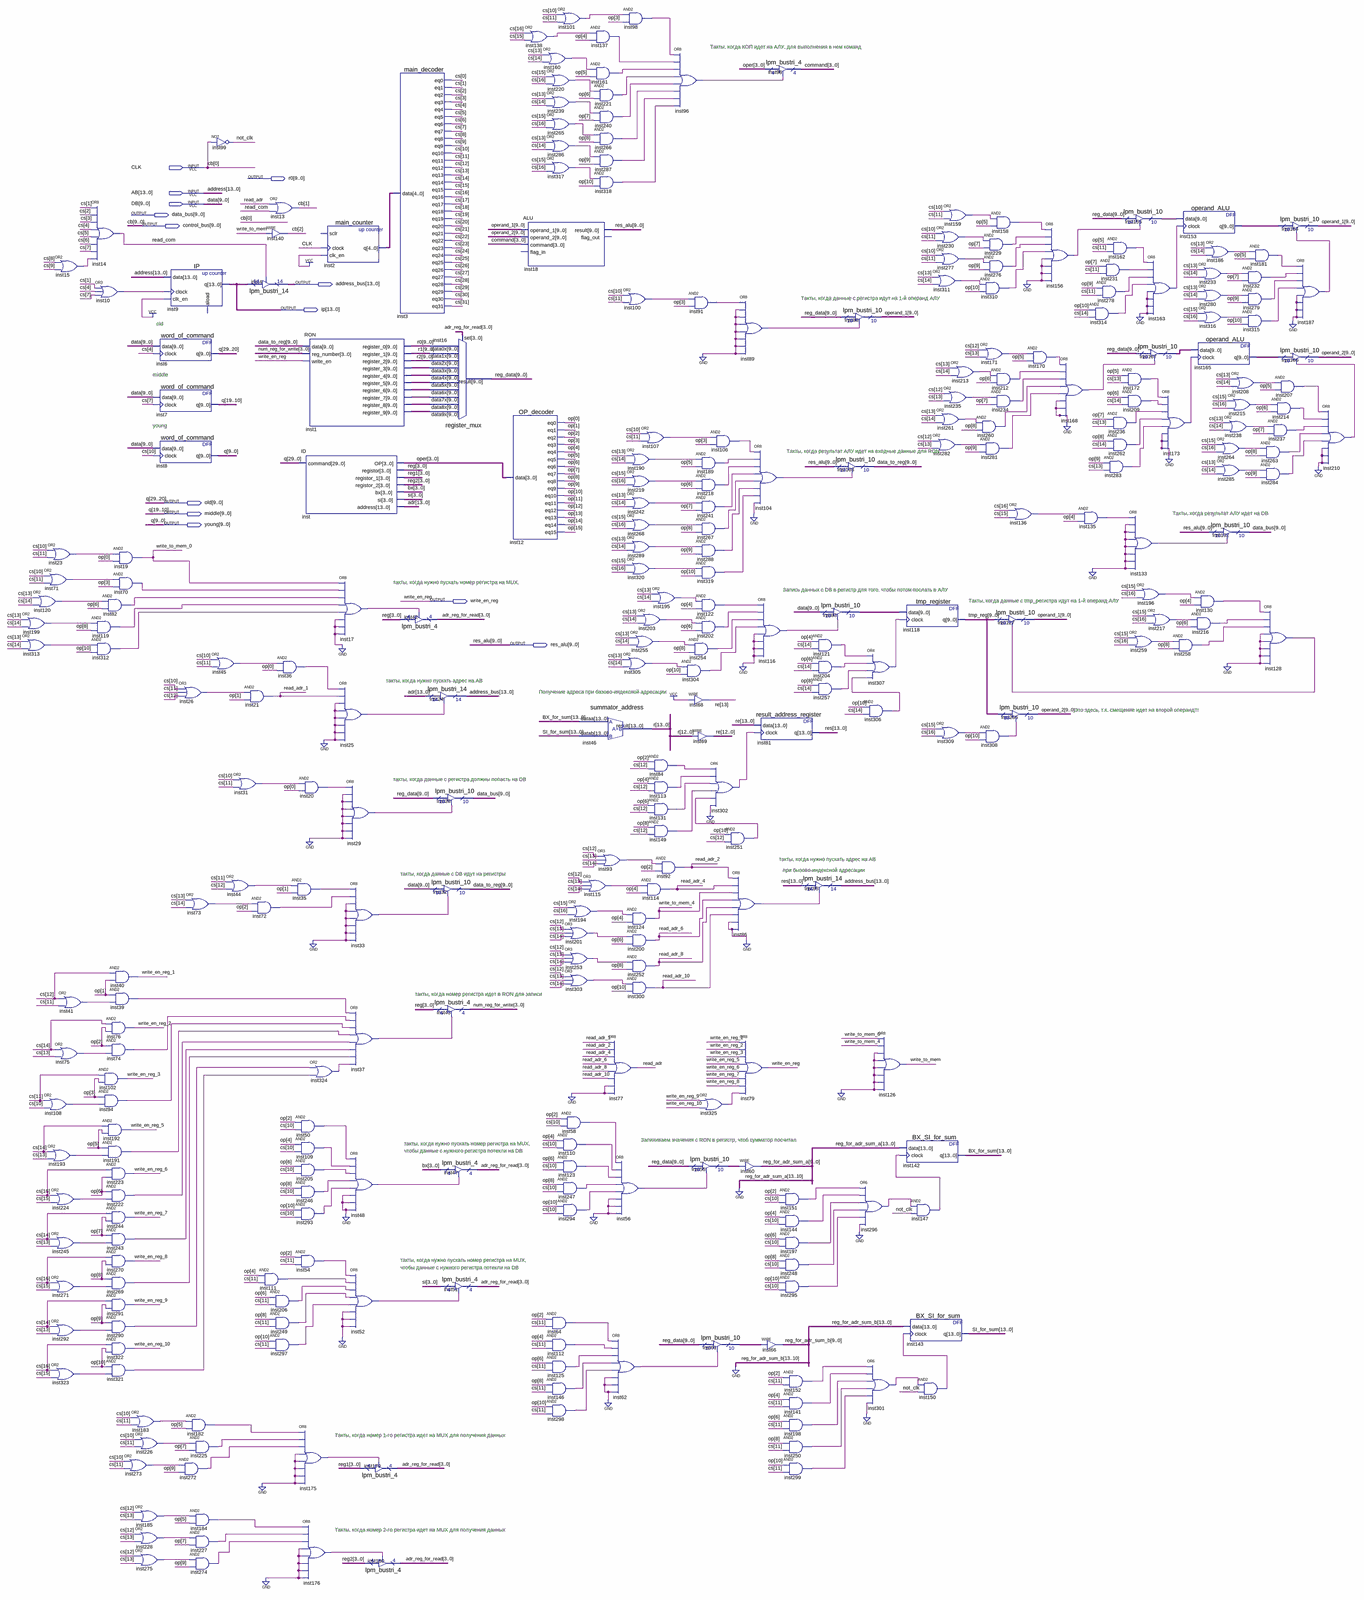
[diagram p0: schematic sheet, whole]
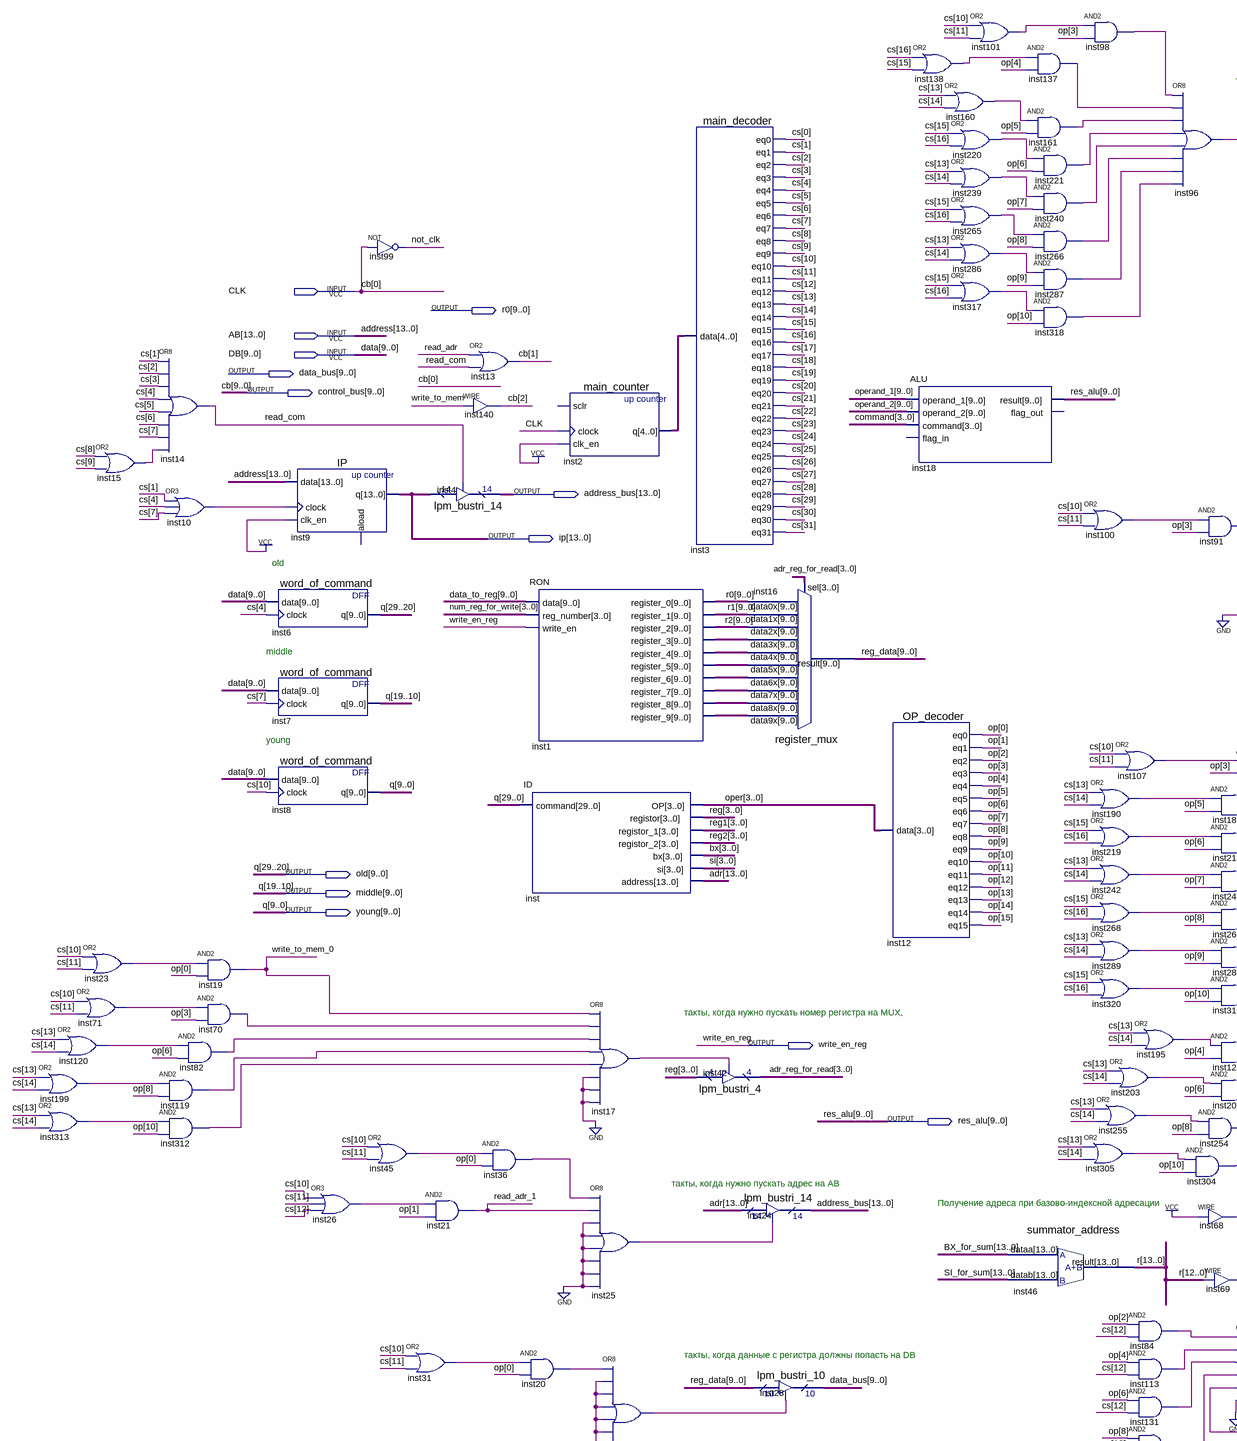
[diagram p1: schematic sheet, upper left part]
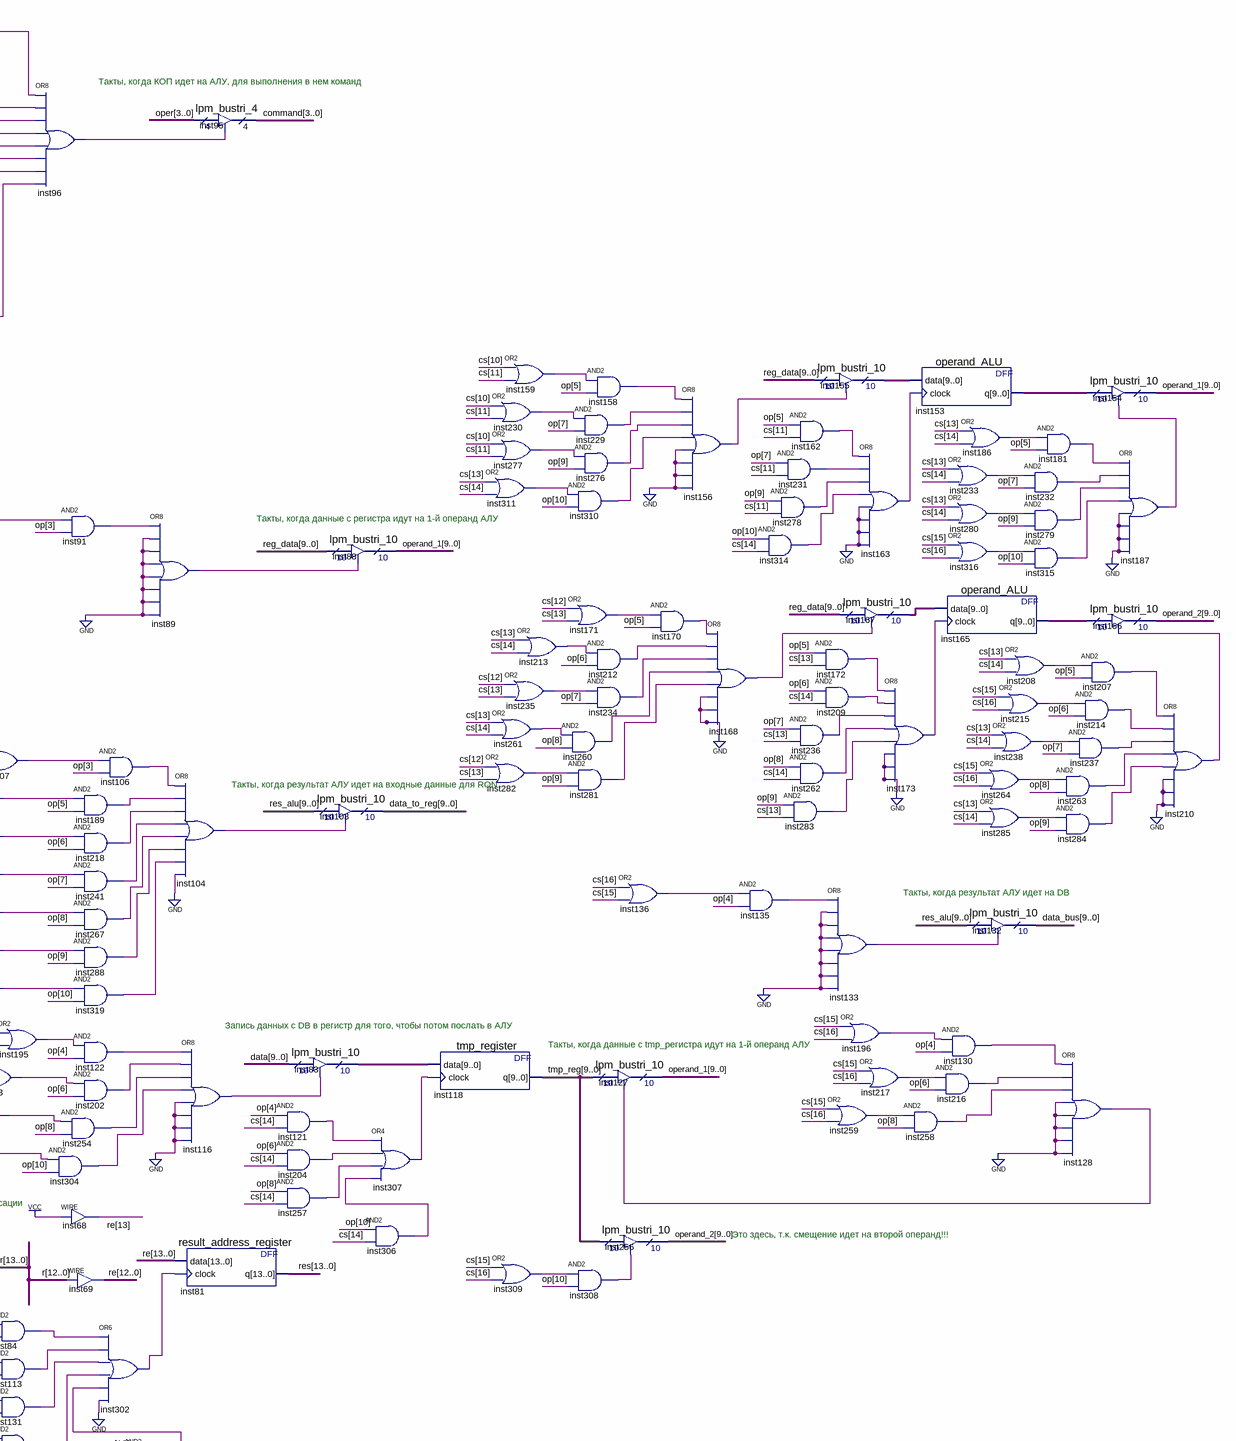
[diagram p2: schematic sheet, upper right part]
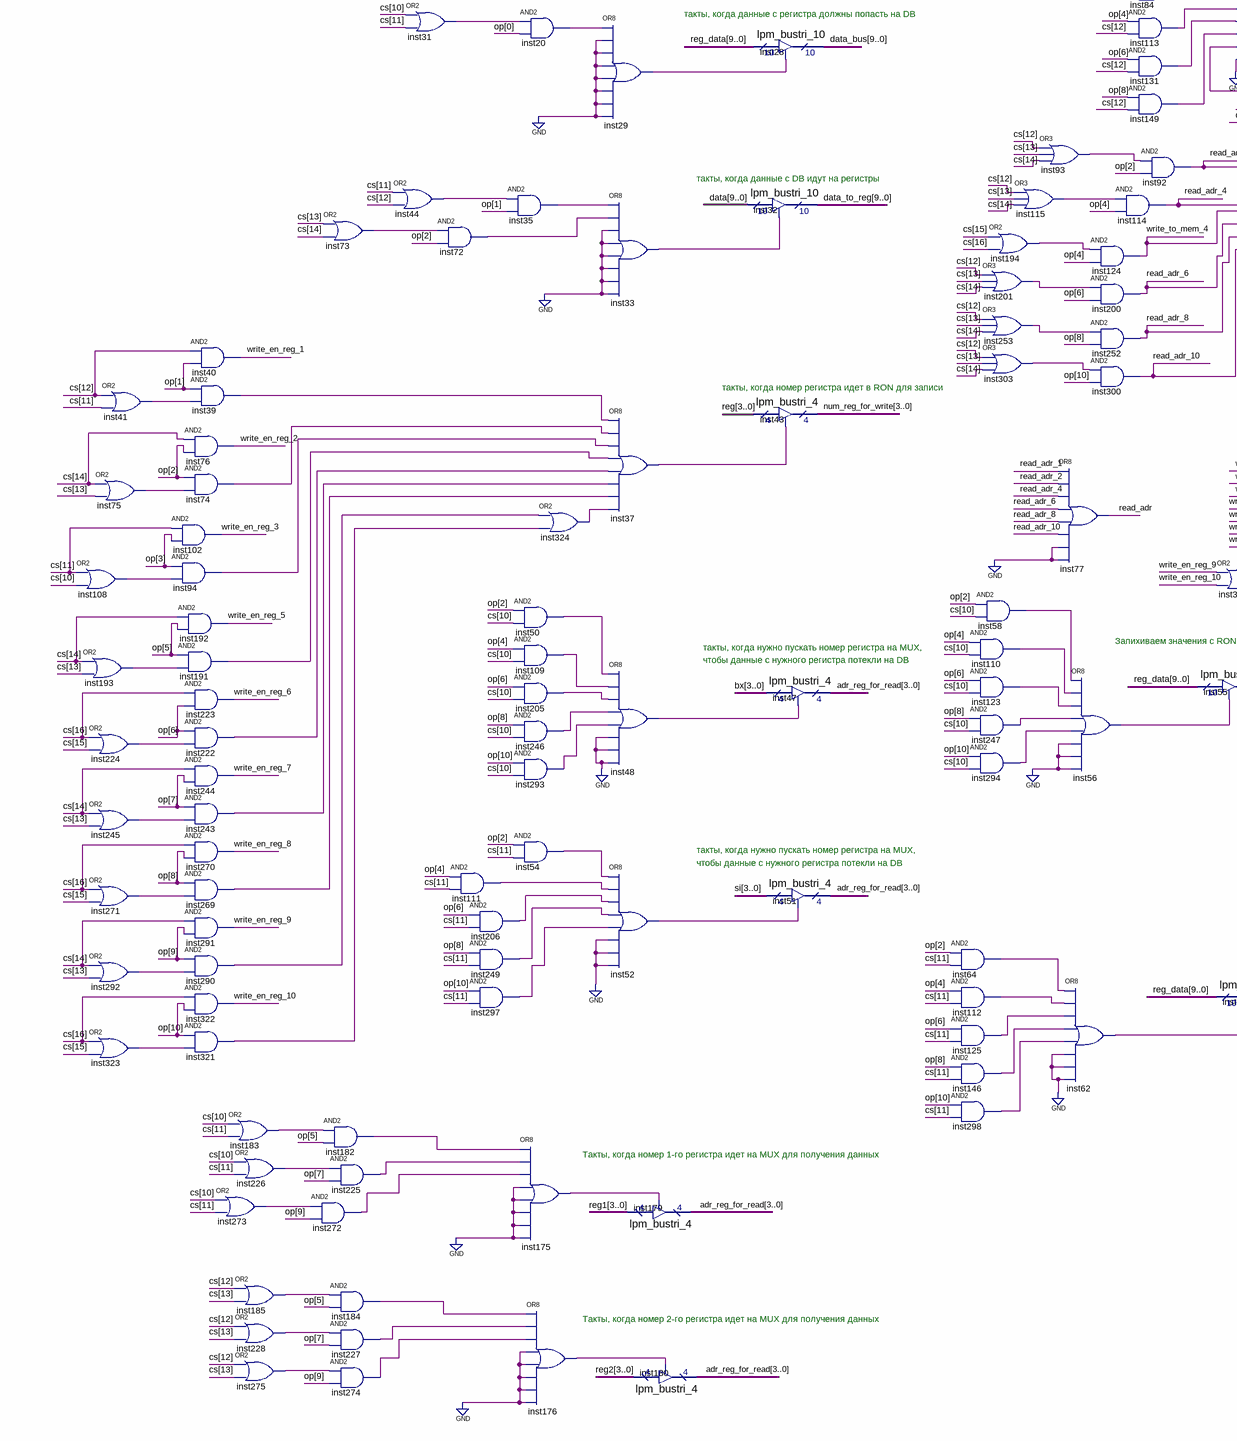
[diagram p3: schematic sheet, lower left part]
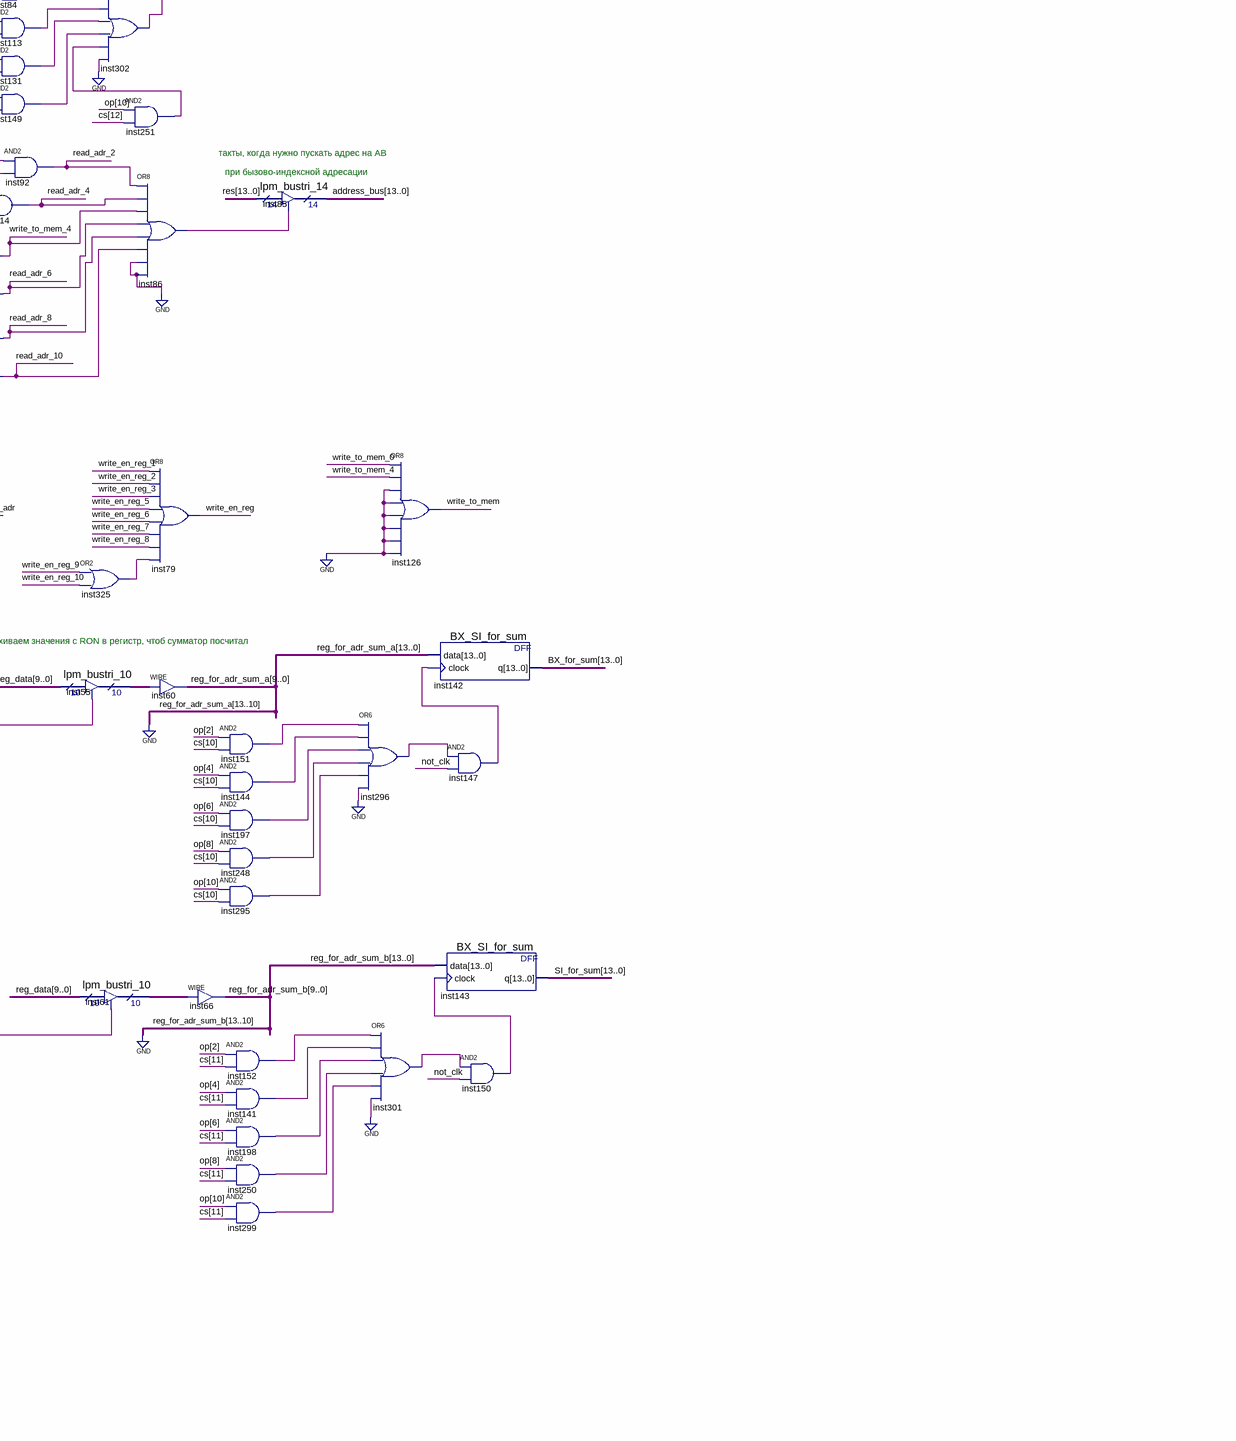
[diagram p4: schematic sheet, lower right part]
// Quartus schematic CPU.bdf as structural Verilog: 292 symbols, 13 pins
module CPU (
  input  CLK,
  input  [13:0] AB,
  input  [9:0] DB,
  output [9:0] r0,
  output [9:0] data_bus,
  output [9:0] control_bus,
  output [13:0] address_bus,
  output [13:0] ip,
  output [9:0] old,
  output [9:0] middle,
  output [9:0] young,
  output write_en_reg,
  output [9:0] res_alu
);

  wire inst10_out, inst15_out, inst17_out, inst20_out, inst23_out, inst25_out, inst26_out, inst29_out,
       inst31_out, inst33_out, inst35_out, inst36_out, inst37_out, inst39_out, inst41_out, inst44_out,
       inst45_out, inst48_out, inst50_out, inst52_out, inst54_out, inst56_out, inst58_out, inst62_out,
       inst64_out, inst70_out, inst71_out, inst72_out, inst73_out, inst74_out, inst75_out, inst82_out,
       inst84_out, inst86_out, inst89_out, inst91_out, inst93_out, inst94_out, inst96_out, inst98_out,
       inst100_out, inst101_out, inst104_out, inst106_out, inst107_out, inst108_out, inst109_out,
       inst110_out, inst111_out, inst112_out, inst113_out, inst115_out, inst116_out, inst119_out,
       inst120_out, inst121_out, inst122_out, inst123_out, inst125_out, inst128_out, inst130_out,
       inst131_out, inst133_out, inst135_out, inst136_out, inst137_out, inst138_out, inst141_out,
       inst144_out, inst146_out, inst147_out, inst149_out, inst150_out, inst151_out, inst152_out,
       inst156_out, inst158_out, inst159_out, inst160_out, inst161_out, inst162_out, inst163_out,
       inst168_out, inst170_out, inst171_out, inst172_out, inst173_out, inst175_out, inst176_out,
       inst181_out, inst182_out, inst183_out, inst184_out, inst185_out, inst186_out, inst187_out,
       inst189_out, inst190_out, inst191_out, inst193_out, inst194_out, inst195_out, inst196_out,
       inst197_out, inst198_out, inst199_out, inst201_out, inst202_out, inst203_out, inst204_out,
       inst205_out, inst206_out, inst207_out, inst208_out, inst209_out, inst210_out, inst212_out,
       inst213_out, inst214_out, inst215_out, inst216_out, inst217_out, inst218_out, inst219_out,
       inst220_out, inst221_out, inst222_out, inst224_out, inst225_out, inst226_out, inst227_out,
       inst228_out, inst229_out, inst230_out, inst231_out, inst232_out, inst233_out, inst234_out,
       inst235_out, inst236_out, inst237_out, inst238_out, inst239_out, inst240_out, inst241_out,
       inst242_out, inst243_out, inst245_out, inst246_out, inst247_out, inst248_out, inst249_out,
       inst250_out, inst251_out, inst253_out, inst254_out, inst255_out, inst257_out, inst258_out,
       inst259_out, inst260_out, inst261_out, inst262_out, inst263_out, inst264_out, inst265_out,
       inst266_out, inst267_out, inst268_out, inst269_out, inst271_out, inst272_out, inst273_out,
       inst274_out, inst275_out, inst276_out, inst277_out, inst278_out, inst279_out, inst280_out,
       inst281_out, inst282_out, inst283_out, inst284_out, inst285_out, inst286_out, inst287_out,
       inst288_out, inst289_out, inst290_out, inst292_out, inst293_out, inst294_out, inst295_out,
       inst296_out, inst297_out, inst298_out, inst299_out, inst301_out, inst302_out, inst303_out,
       inst304_out, inst305_out, inst306_out, inst307_out, inst308_out, inst309_out, inst310_out,
       inst311_out, inst312_out, inst313_out, inst314_out, inst315_out, inst316_out, inst317_out,
       inst318_out, inst319_out, inst320_out, inst321_out, inst323_out, inst324_out, inst325_out, not_clk,
       read_adr, read_adr_1, read_adr_2, read_adr_4, read_adr_6, read_adr_8, read_adr_10, read_com,
       write_en_reg_1, write_en_reg_2, write_en_reg_3, write_en_reg_5, write_en_reg_6, write_en_reg_7,
       write_en_reg_8, write_en_reg_9, write_en_reg_10, write_to_mem, write_to_mem_0, write_to_mem_4;
  wire [3:0] adr_reg_for_read, bx, command, num_reg_for_write, oper, \reg , reg1, reg2, si;
  wire [4:0] inst2_q;
  wire [9:0] data_to_reg, inst1_register_3, inst1_register_4, inst1_register_5, inst1_register_6,
       inst1_register_7, inst1_register_8, inst1_register_9, inst55_tridata, inst61_tridata, inst83_tridata,
       inst153_q, inst155_tridata, inst165_q, inst167_tridata, operand_1, operand_2, r1, r2, reg_data,
       reg_for_adr_sum_a, reg_for_adr_sum_b, tmp_reg;
  wire [13:0] adr, BX_for_sum, r, re, res, SI_for_sum;
  wire [15:0] op;
  wire [31:0] cs;

  or inst71 (inst71_out, cs[10], cs[11]);
  or inst120 (inst120_out, cs[13], cs[14]);
  or inst199 (inst199_out, cs[13], cs[14]);
  or inst313 (inst313_out, cs[13], cs[14]);
  or inst108 (inst108_out, cs[11], cs[10]);
  or inst15 (inst15_out, cs[8], cs[9]);
  or inst23 (inst23_out, cs[10], cs[11]);
  or inst41 (inst41_out, cs[12], cs[11]);
  or inst75 (inst75_out, cs[14], cs[13]);
  or inst193 (inst193_out, cs[14], cs[13]);
  or inst224 (inst224_out, cs[16], cs[15]);
  or inst245 (inst245_out, cs[14], cs[13]);
  or inst271 (inst271_out, cs[16], cs[15]);
  or inst292 (inst292_out, cs[14], cs[13]);
  or inst323 (inst323_out, cs[16], cs[15]);
  or inst14 (read_com, cs[1], cs[2], cs[3], cs[4], cs[5], cs[6], cs[7], inst15_out);
  or inst10 (inst10_out, cs[1], cs[4], cs[7]);
  and inst82 (inst82_out, inst120_out, op[6]);
  and inst119 (inst119_out, inst199_out, op[8]);
  and inst312 (inst312_out, inst313_out, op[10]);
  and inst102 (write_en_reg_3, cs[11], op[3]);
  and inst94 (inst94_out, op[3], inst108_out);
  and inst192 (write_en_reg_5, cs[14], op[5]);
  and inst191 (inst191_out, op[5], inst193_out);
  and inst19 (write_to_mem_0, inst23_out, op[0]);
  and inst70 (inst70_out, inst71_out, op[3]);
  and inst40 (write_en_reg_1, cs[12], op[1]);
  and inst39 (inst39_out, op[1], inst41_out);
  and inst76 (write_en_reg_2, cs[14], op[2]);
  and inst74 (inst74_out, op[2], inst75_out);
  and inst223 (write_en_reg_6, cs[16], op[6]);
  and inst222 (inst222_out, op[6], inst224_out);
  and inst244 (write_en_reg_7, cs[14], op[7]);
  and inst243 (inst243_out, op[7], inst245_out);
  and inst270 (write_en_reg_8, cs[16], op[8]);
  and inst269 (inst269_out, op[8], inst271_out);
  and inst291 (write_en_reg_9, cs[14], op[9]);
  and inst290 (inst290_out, op[9], inst292_out);
  and inst322 (write_en_reg_10, cs[16], op[10]);
  and inst321 (inst321_out, op[10], inst323_out);
  or inst183 (inst183_out, cs[10], cs[11]);
  or inst273 (inst273_out, cs[10], cs[11]);
  word_of_command inst6 (.data(DB), .clock(cs[4]), .q(old));
  word_of_command inst7 (.data(DB), .clock(cs[7]), .q(middle));
  word_of_command inst8 (.data(DB), .clock(cs[10]), .q(young));
  or inst226 (inst226_out, cs[10], cs[11]);
  or inst185 (inst185_out, cs[12], cs[13]);
  or inst228 (inst228_out, cs[12], cs[13]);
  or inst275 (inst275_out, cs[12], cs[13]);
  IP inst9 (.data(AB), .clock(inst10_out), .clk_en(1'b1), .q(ip));  // open: aload
  or inst26 (inst26_out, cs[10], cs[11], cs[12]);
  or inst73 (inst73_out, cs[13], cs[14]);
  and inst182 (inst182_out, inst183_out, op[5]);
  and inst225 (inst225_out, inst226_out, op[7]);
  and inst272 (inst272_out, inst273_out, op[9]);
  and inst184 (inst184_out, inst185_out, op[5]);
  and inst227 (inst227_out, inst228_out, op[7]);
  and inst274 (inst274_out, inst275_out, op[9]);
  not inst99 (not_clk, CLK);
  or inst45 (inst45_out, cs[10], cs[11]);
  lpm_bustri_14 inst4 (.enabledt(read_com), .data(ip), .tridata(address_bus));
  and inst21 (read_adr_1, inst26_out, op[1]);
  or inst31 (inst31_out, cs[10], cs[11]);
  or inst44 (inst44_out, cs[11], cs[12]);
  or inst13 (control_bus[1], read_adr, read_com);
  assign control_bus[2] = write_to_mem;  // WIRE inst140
  and inst36 (inst36_out, inst45_out, op[0]);
  and inst72 (inst72_out, inst73_out, op[2]);
  and inst111 (inst111_out, op[4], cs[11]);
  and inst206 (inst206_out, op[6], cs[11]);
  and inst249 (inst249_out, op[8], cs[11]);
  and inst297 (inst297_out, op[10], cs[11]);
  RON inst1 (
    .data(data_to_reg), .reg_number(num_reg_for_write), .write_en(write_en_reg), .register_0(r0),
    .register_1(r1), .register_2(r2), .register_3(inst1_register_3), .register_4(inst1_register_4),
    .register_5(inst1_register_5), .register_6(inst1_register_6), .register_7(inst1_register_7),
    .register_8(inst1_register_8), .register_9(inst1_register_9));
  ID inst (
    .command({old, middle, young}), .OP(oper), .registor(\reg ), .registor_1(reg1), .registor_2(reg2),
    .bx(bx), .si(si), .address(adr));
  and inst20 (inst20_out, inst31_out, op[0]);
  and inst35 (inst35_out, inst44_out, op[1]);
  and inst50 (inst50_out, op[2], cs[10]);
  and inst109 (inst109_out, op[4], cs[10]);
  and inst205 (inst205_out, op[6], cs[10]);
  and inst246 (inst246_out, op[8], cs[10]);
  and inst293 (inst293_out, op[10], cs[10]);
  and inst54 (inst54_out, op[2], cs[11]);
  or inst175 (inst175_out, inst182_out, inst225_out, inst272_out, 1'b0, 1'b0, 1'b0, 1'b0, 1'b0);
  or inst176 (inst176_out, inst184_out, inst227_out, inst274_out, 1'b0, 1'b0, 1'b0, 1'b0, 1'b0);
  main_counter inst2 (.clock(CLK), .clk_en(1'b1), .q(inst2_q));  // open: sclr
  or inst324 (inst324_out, inst290_out, inst321_out);
  or inst17 (inst17_out, write_to_mem_0, inst70_out, inst82_out, inst119_out, inst312_out, 1'b0, 1'b0, 1'b0);
  or inst25 (inst25_out, inst36_out, read_adr_1, 1'b0, 1'b0, 1'b0, 1'b0, 1'b0, 1'b0);
  or inst29 (inst29_out, inst20_out, 1'b0, 1'b0, 1'b0, 1'b0, 1'b0, 1'b0, 1'b0);
  or inst33 (inst33_out, inst35_out, inst72_out, 1'b0, 1'b0, 1'b0, 1'b0, 1'b0, 1'b0);
  or inst37 (inst37_out, inst39_out, inst74_out, inst94_out, inst191_out, inst222_out, inst243_out, inst269_out, inst324_out);
  or inst48 (inst48_out, inst50_out, inst109_out, inst205_out, inst246_out, inst293_out, 1'b0, 1'b0, 1'b0);
  or inst52 (inst52_out, inst54_out, inst111_out, inst206_out, inst249_out, inst297_out, 1'b0, 1'b0, 1'b0);
  lpm_bustri_4 inst179 (.enabledt(inst175_out), .data(reg1), .tridata(adr_reg_for_read));
  lpm_bustri_4 inst180 (.enabledt(inst176_out), .data(reg2), .tridata(adr_reg_for_read));
  main_decoder inst3 (
    .data(inst2_q), .eq0(cs[0]), .eq1(cs[1]), .eq2(cs[2]), .eq3(cs[3]), .eq4(cs[4]), .eq5(cs[5]),
    .eq6(cs[6]), .eq7(cs[7]), .eq8(cs[8]), .eq9(cs[9]), .eq10(cs[10]), .eq11(cs[11]), .eq12(cs[12]),
    .eq13(cs[13]), .eq14(cs[14]), .eq15(cs[15]), .eq16(cs[16]), .eq17(cs[17]), .eq18(cs[18]), .eq19(cs[19]),
    .eq20(cs[20]), .eq21(cs[21]), .eq22(cs[22]), .eq23(cs[23]), .eq24(cs[24]), .eq25(cs[25]), .eq26(cs[26]),
    .eq27(cs[27]), .eq28(cs[28]), .eq29(cs[29]), .eq30(cs[30]), .eq31(cs[31]));
  lpm_bustri_4 inst42 (.enabledt(inst17_out), .data(\reg ), .tridata(adr_reg_for_read));
  register_mux inst16 (
    .data9x(inst1_register_9), .data8x(inst1_register_8), .data7x(inst1_register_7),
    .data6x(inst1_register_6), .data5x(inst1_register_5), .data4x(inst1_register_4),
    .data3x(inst1_register_3), .data2x(r2), .data1x(r1), .data0x(r0), .sel(adr_reg_for_read),
    .result(reg_data));
  lpm_bustri_14 inst24 (.enabledt(inst25_out), .data(adr), .tridata(address_bus));
  lpm_bustri_10 inst28 (.enabledt(inst29_out), .data(reg_data), .tridata(data_bus));
  lpm_bustri_10 inst32 (.enabledt(inst33_out), .data(DB), .tridata(data_to_reg));
  lpm_bustri_4 inst43 (.enabledt(inst37_out), .data(\reg ), .tridata(num_reg_for_write));
  lpm_bustri_4 inst47 (.enabledt(inst48_out), .data(bx), .tridata(adr_reg_for_read));
  lpm_bustri_4 inst51 (.enabledt(inst52_out), .data(si), .tridata(adr_reg_for_read));
  OP_decoder inst12 (
    .data(oper), .eq0(op[0]), .eq1(op[1]), .eq2(op[2]), .eq3(op[3]), .eq4(op[4]), .eq5(op[5]), .eq6(op[6]),
    .eq7(op[7]), .eq8(op[8]), .eq9(op[9]), .eq10(op[10]), .eq11(op[11]), .eq12(op[12]), .eq13(op[13]),
    .eq14(op[14]), .eq15(op[15]));
  or inst138 (inst138_out, cs[16], cs[15]);
  ALU inst18 (
    .operand_1(operand_1), .operand_2(operand_2), .command(command), .result(res_alu));  // open: flag_in, flag_out
  or inst101 (inst101_out, cs[10], cs[11]);
  or inst160 (inst160_out, cs[13], cs[14]);
  or inst220 (inst220_out, cs[15], cs[16]);
  or inst239 (inst239_out, cs[13], cs[14]);
  or inst265 (inst265_out, cs[15], cs[16]);
  or inst286 (inst286_out, cs[13], cs[14]);
  or inst317 (inst317_out, cs[15], cs[16]);
  or inst194 (inst194_out, cs[15], cs[16]);
  or inst201 (inst201_out, cs[12], cs[13], cs[14]);
  or inst253 (inst253_out, cs[12], cs[13], cs[14]);
  or inst303 (inst303_out, cs[12], cs[13], cs[14]);
  and inst58 (inst58_out, op[2], cs[10]);
  and inst110 (inst110_out, op[4], cs[10]);
  and inst123 (inst123_out, op[6], cs[10]);
  and inst247 (inst247_out, op[8], cs[10]);
  and inst294 (inst294_out, op[10], cs[10]);
  and inst64 (inst64_out, op[2], cs[11]);
  and inst112 (inst112_out, op[4], cs[11]);
  and inst125 (inst125_out, op[6], cs[11]);
  and inst146 (inst146_out, op[8], cs[11]);
  and inst298 (inst298_out, op[10], cs[11]);
  and inst137 (inst137_out, inst138_out, op[4]);
  and inst161 (inst161_out, inst160_out, op[5]);
  and inst221 (inst221_out, inst220_out, op[6]);
  and inst240 (inst240_out, inst239_out, op[7]);
  and inst266 (inst266_out, inst265_out, op[8]);
  and inst287 (inst287_out, inst286_out, op[9]);
  and inst318 (inst318_out, inst317_out, op[10]);
  summator_address inst46 (.dataa(BX_for_sum), .datab(SI_for_sum), .result(r));
  or inst93 (inst93_out, cs[12], cs[13], cs[14]);
  or inst115 (inst115_out, cs[12], cs[13], cs[14]);
  and inst98 (inst98_out, inst101_out, op[3]);
  or inst100 (inst100_out, cs[10], cs[11]);
  or inst190 (inst190_out, cs[13], cs[14]);
  or inst219 (inst219_out, cs[15], cs[16]);
  or inst242 (inst242_out, cs[13], cs[14]);
  or inst268 (inst268_out, cs[15], cs[16]);
  or inst289 (inst289_out, cs[13], cs[14]);
  or inst320 (inst320_out, cs[15], cs[16]);
  or inst305 (inst305_out, cs[13], cs[14]);
  and inst124 (write_to_mem_4, inst194_out, op[4]);
  and inst200 (read_adr_6, inst201_out, op[6]);
  and inst252 (read_adr_8, inst253_out, op[8]);
  and inst300 (read_adr_10, inst303_out, op[10]);
  or inst77 (read_adr, read_adr_1, read_adr_2, read_adr_4, read_adr_6, read_adr_8, read_adr_10, 1'b0, 1'b0);
  or inst56 (inst56_out, inst58_out, inst110_out, inst123_out, inst247_out, inst294_out, 1'b0, 1'b0, 1'b0);
  or inst62 (inst62_out, inst64_out, inst112_out, inst125_out, inst146_out, inst298_out, 1'b0, 1'b0, 1'b0);
  or inst107 (inst107_out, cs[10], cs[11]);
  or inst195 (inst195_out, cs[13], cs[14]);
  or inst203 (inst203_out, cs[13], cs[14]);
  or inst255 (inst255_out, cs[13], cs[14]);
  and inst84 (inst84_out, op[2], cs[12]);
  and inst113 (inst113_out, op[4], cs[12]);
  and inst131 (inst131_out, op[6], cs[12]);
  and inst149 (inst149_out, op[8], cs[12]);
  and inst92 (read_adr_2, inst93_out, op[2]);
  and inst114 (read_adr_4, inst115_out, op[4]);
  or inst96 (inst96_out, inst98_out, inst137_out, inst161_out, inst221_out, inst240_out, inst266_out, inst287_out, inst318_out);
  and inst304 (inst304_out, inst305_out, op[10]);
  and inst91 (inst91_out, inst100_out, op[3]);
  and inst106 (inst106_out, inst107_out, op[3]);
  and inst189 (inst189_out, inst190_out, op[5]);
  and inst218 (inst218_out, inst219_out, op[6]);
  and inst241 (inst241_out, inst242_out, op[7]);
  and inst267 (inst267_out, inst268_out, op[8]);
  and inst288 (inst288_out, inst289_out, op[9]);
  and inst319 (inst319_out, inst320_out, op[10]);
  and inst122 (inst122_out, inst195_out, op[4]);
  and inst202 (inst202_out, inst203_out, op[6]);
  and inst254 (inst254_out, inst255_out, op[8]);
  assign re[13] = 1'b1;  // WIRE inst68
  assign re[12:0] = r[12:0];  // WIRE inst69
  or inst302 (inst302_out, inst84_out, inst113_out, inst131_out, inst149_out, inst251_out, 1'b0);
  or inst325 (inst325_out, write_en_reg_9, write_en_reg_10);
  lpm_bustri_10 inst55 (.enabledt(inst56_out), .data(reg_data), .tridata(inst55_tridata));
  lpm_bustri_10 inst61 (.enabledt(inst62_out), .data(reg_data), .tridata(inst61_tridata));
  or inst89 (inst89_out, inst91_out, 1'b0, 1'b0, 1'b0, 1'b0, 1'b0, 1'b0, 1'b0);
  and inst251 (inst251_out, op[10], cs[12]);
  or inst86 (inst86_out, read_adr_2, read_adr_4, write_to_mem_4, read_adr_6, read_adr_8, read_adr_10, 1'b0, 1'b0);
  or inst79 (write_en_reg, write_en_reg_1, write_en_reg_2, write_en_reg_3, write_en_reg_5, write_en_reg_6, write_en_reg_7, write_en_reg_8, inst325_out);
  assign reg_for_adr_sum_a = inst55_tridata;  // WIRE inst60
  lpm_bustri_4 inst95 (.enabledt(inst96_out), .data(oper), .tridata(command));
  or inst104 (inst104_out, inst106_out, inst189_out, inst218_out, inst241_out, inst267_out, inst288_out, inst319_out, 1'b0);
  or inst116 (inst116_out, inst122_out, inst202_out, inst254_out, inst304_out, 1'b0, 1'b0, 1'b0, 1'b0);
  result_address_register inst81 (.data(re), .clock(inst302_out), .q(res));
  assign reg_for_adr_sum_b = inst61_tridata;  // WIRE inst66
  lpm_bustri_14 inst85 (.enabledt(inst86_out), .data(res), .tridata(address_bus));
  and inst151 (inst151_out, op[2], cs[10]);
  and inst144 (inst144_out, op[4], cs[10]);
  and inst197 (inst197_out, op[6], cs[10]);
  and inst248 (inst248_out, op[8], cs[10]);
  and inst295 (inst295_out, op[10], cs[10]);
  and inst152 (inst152_out, op[2], cs[11]);
  and inst141 (inst141_out, op[4], cs[11]);
  and inst198 (inst198_out, op[6], cs[11]);
  and inst250 (inst250_out, op[8], cs[11]);
  and inst299 (inst299_out, op[10], cs[11]);
  lpm_bustri_10 inst83 (.enabledt(inst116_out), .data(DB), .tridata(inst83_tridata));
  and inst121 (inst121_out, op[4], cs[14]);
  and inst204 (inst204_out, op[6], cs[14]);
  and inst257 (inst257_out, op[8], cs[14]);
  lpm_bustri_10 inst88 (.enabledt(inst89_out), .data(reg_data), .tridata(operand_1));
  lpm_bustri_10 inst103 (.enabledt(inst104_out), .data(res_alu), .tridata(data_to_reg));
  or inst296 (inst296_out, inst151_out, inst144_out, inst197_out, inst248_out, inst295_out, 1'b0);
  or inst307 (inst307_out, inst121_out, inst204_out, inst257_out, inst306_out);
  and inst306 (inst306_out, op[10], cs[14]);
  or inst126 (write_to_mem, write_to_mem_0, write_to_mem_4, 1'b0, 1'b0, 1'b0, 1'b0, 1'b0, 1'b0);
  or inst301 (inst301_out, inst152_out, inst141_out, inst198_out, inst250_out, inst299_out, 1'b0);
  tmp_register inst118 (.data(inst83_tridata), .clock(inst307_out), .q(tmp_reg));
  BX_SI_for_sum inst142 (.data({4'b0000, reg_for_adr_sum_a}), .clock(inst147_out), .q(BX_for_sum));
  and inst147 (inst147_out, inst296_out, not_clk);
  BX_SI_for_sum inst143 (.data({4'b0000, reg_for_adr_sum_b}), .clock(inst150_out), .q(SI_for_sum));
  and inst150 (inst150_out, inst301_out, not_clk);
  or inst159 (inst159_out, cs[10], cs[11]);
  or inst230 (inst230_out, cs[10], cs[11]);
  or inst277 (inst277_out, cs[10], cs[11]);
  or inst311 (inst311_out, cs[13], cs[14]);
  or inst235 (inst235_out, cs[12], cs[13]);
  or inst261 (inst261_out, cs[13], cs[14]);
  or inst282 (inst282_out, cs[12], cs[13]);
  or inst309 (inst309_out, cs[15], cs[16]);
  or inst213 (inst213_out, cs[13], cs[14]);
  and inst260 (inst260_out, inst261_out, op[8]);
  and inst158 (inst158_out, inst159_out, op[5]);
  and inst229 (inst229_out, inst230_out, op[7]);
  and inst276 (inst276_out, inst277_out, op[9]);
  and inst310 (inst310_out, inst311_out, op[10]);
  or inst171 (inst171_out, cs[12], cs[13]);
  and inst212 (inst212_out, inst213_out, op[6]);
  and inst234 (inst234_out, inst235_out, op[7]);
  and inst281 (inst281_out, inst282_out, op[9]);
  lpm_bustri_10 inst127 (.enabledt(inst128_out), .data(tmp_reg), .tridata(operand_1));
  lpm_bustri_10 inst256 (.enabledt(inst308_out), .data(tmp_reg), .tridata(operand_2));
  and inst308 (inst308_out, inst309_out, op[10]);
  and inst170 (inst170_out, inst171_out, op[5]);
  or inst136 (inst136_out, cs[16], cs[15]);
  or inst156 (inst156_out, inst158_out, inst229_out, inst276_out, inst310_out, 1'b0, 1'b0, 1'b0, 1'b0);
  or inst168 (inst168_out, inst170_out, inst212_out, inst234_out, inst260_out, inst281_out, 1'b0, 1'b0, 1'b0);
  and inst314 (inst314_out, op[10], cs[14]);
  and inst135 (inst135_out, inst136_out, op[4]);
  lpm_bustri_10 inst155 (.enabledt(inst156_out), .data(reg_data), .tridata(inst155_tridata));
  and inst162 (inst162_out, op[5], cs[11]);
  and inst231 (inst231_out, op[7], cs[11]);
  and inst278 (inst278_out, op[9], cs[11]);
  and inst172 (inst172_out, op[5], cs[13]);
  and inst209 (inst209_out, op[6], cs[14]);
  and inst236 (inst236_out, op[7], cs[13]);
  and inst262 (inst262_out, op[8], cs[14]);
  and inst283 (inst283_out, op[9], cs[13]);
  or inst163 (inst163_out, inst162_out, inst231_out, inst278_out, inst314_out, 1'b0, 1'b0, 1'b0, 1'b0);
  lpm_bustri_10 inst167 (.enabledt(inst168_out), .data(reg_data), .tridata(inst167_tridata));
  or inst133 (inst133_out, inst135_out, 1'b0, 1'b0, 1'b0, 1'b0, 1'b0, 1'b0, 1'b0);
  or inst196 (inst196_out, cs[15], cs[16]);
  or inst217 (inst217_out, cs[15], cs[16]);
  or inst259 (inst259_out, cs[15], cs[16]);
  operand_ALU inst153 (.data(inst155_tridata), .clock(inst163_out), .q(inst153_q));
  or inst173 (inst173_out, inst172_out, inst209_out, inst236_out, inst262_out, inst283_out, 1'b0, 1'b0, 1'b0);
  and inst258 (inst258_out, inst259_out, op[8]);
  or inst186 (inst186_out, cs[13], cs[14]);
  or inst233 (inst233_out, cs[13], cs[14]);
  or inst280 (inst280_out, cs[13], cs[14]);
  or inst316 (inst316_out, cs[15], cs[16]);
  operand_ALU inst165 (.data(inst167_tridata), .clock(inst173_out), .q(inst165_q));
  lpm_bustri_10 inst132 (.enabledt(inst133_out), .data(res_alu), .tridata(data_bus));
  and inst130 (inst130_out, inst196_out, op[4]);
  and inst216 (inst216_out, inst217_out, op[6]);
  or inst208 (inst208_out, cs[13], cs[14]);
  or inst215 (inst215_out, cs[15], cs[16]);
  or inst238 (inst238_out, cs[13], cs[14]);
  or inst264 (inst264_out, cs[15], cs[16]);
  or inst285 (inst285_out, cs[13], cs[14]);
  and inst181 (inst181_out, inst186_out, op[5]);
  and inst232 (inst232_out, inst233_out, op[7]);
  and inst279 (inst279_out, inst280_out, op[9]);
  and inst315 (inst315_out, inst316_out, op[10]);
  and inst237 (inst237_out, inst238_out, op[7]);
  and inst263 (inst263_out, inst264_out, op[8]);
  and inst284 (inst284_out, inst285_out, op[9]);
  or inst128 (inst128_out, inst130_out, inst216_out, inst258_out, 1'b0, 1'b0, 1'b0, 1'b0, 1'b0);
  lpm_bustri_10 inst154 (.enabledt(inst187_out), .data(inst153_q), .tridata(operand_1));
  or inst187 (inst187_out, inst181_out, inst232_out, inst279_out, inst315_out, 1'b0, 1'b0, 1'b0, 1'b0);
  lpm_bustri_10 inst166 (.enabledt(inst210_out), .data(inst165_q), .tridata(operand_2));
  and inst207 (inst207_out, inst208_out, op[5]);
  and inst214 (inst214_out, inst215_out, op[6]);
  or inst210 (inst210_out, inst207_out, inst214_out, inst237_out, inst263_out, inst284_out, 1'b0, 1'b0, 1'b0);

  assign control_bus[0] = CLK;

  // Other names for the same wires on the sheet: address[13:0] = AB; cb[9:0] = {control_bus[9:1], CLK};
  //   data[9:0] = DB; q[29:0] = {old, middle, young}

  // Notes on the sheet:
  //   Такты, когда КОП идет на АЛУ, для выполнения в нем команд
  //   Такты, когда данные с регистра идут на 1-й операнд АЛУ
  //   old
  //   middle
  //   young
  //   Такты, когда результат АЛУ идет на входные данные для RON
  //   Такты, когда результат АЛУ идет на DB
  //   такты, когда нужно пускать номер регистра на MUX,
  //   Запись данных с DB в регистр для того, чтобы потом послать в АЛУ
  //   Такты, когда данные с tmp_регистра идут на 1-й операнд АЛУ
  //   такты, когда нужно пускать адрес на AB
  //   Получение адреса при базово-индексной адресации
  //   Это здесь, т.к. смещение идет на второй операнд!!!
  //   такты, когда данные с регистра должны попасть на DB
  //   такты, когда нужно пускать адрес на AB
  //   при бызово-индексной адресации
  //   такты, когда данные с DB идут на регистры
  //   такты, когда номер регистра идет в RON для записи
  //   Запихиваем значения с RON в регистр, чтоб сумматор посчитал
  //   такты, когда нужно пускать номер регистра на MUX,
  //   чтобы данные с нужного регистра потекли на DB
  //   такты, когда нужно пускать номер регистра на MUX,
  //   чтобы данные с нужного регистра потекли на DB
  //   Такты, когда номер 1-го регистра идет на MUX для получения данных
  //   Такты, когда номер 2-го регистра идет на MUX для получения данных
endmodule
